# EAGLE schematic board (EAGLE 9.6.0)
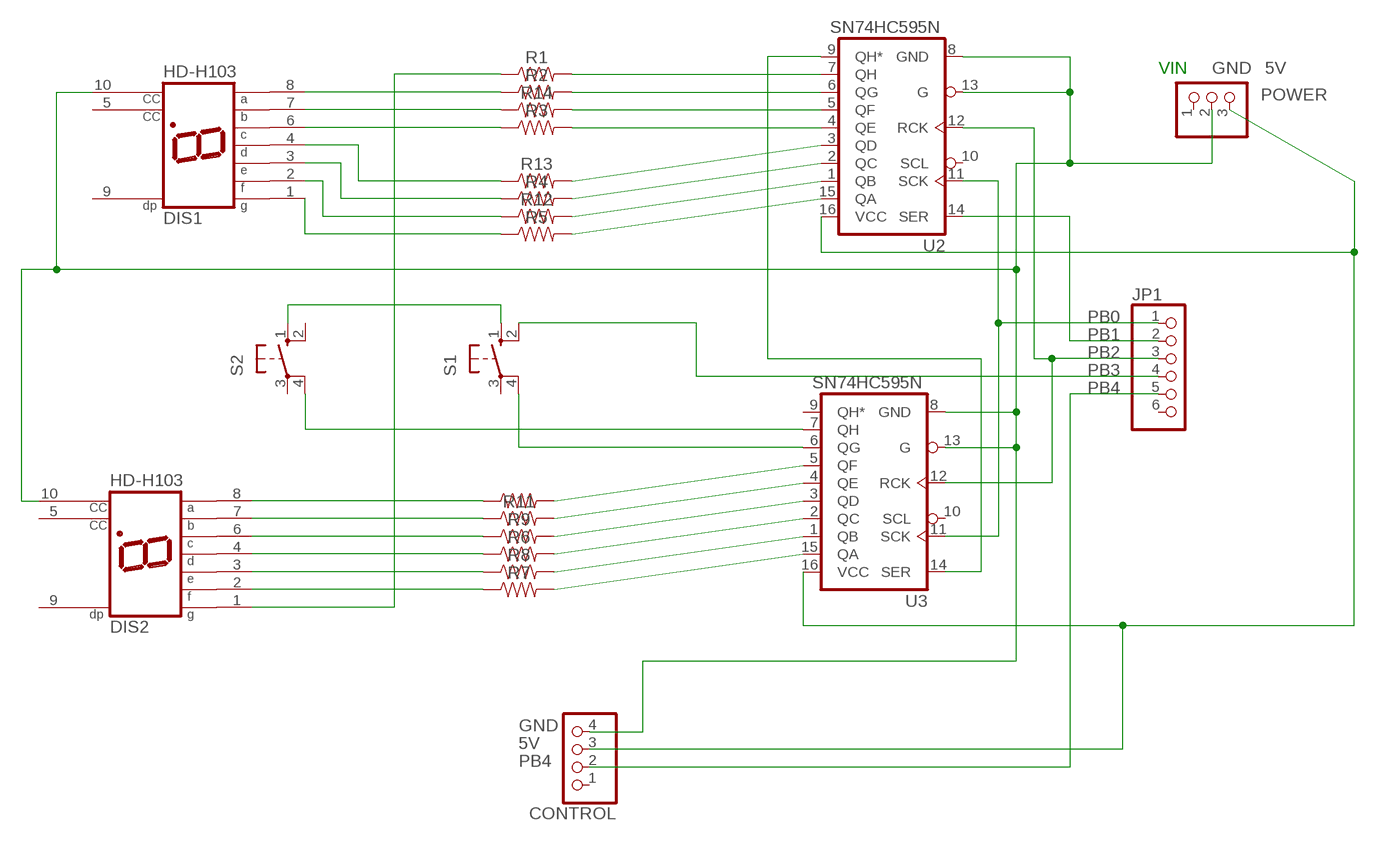
[diagram p0: schematic, sheet 1]

## Parts
CONTROL  PINHD-1X4  [1X04]
DIS1  HD-H103  [HDSP-M]
DIS2  HD-H103  [HDSP-M]
JP1  PINHD-1X6  [1X06]
POWER  PINHD-1X3  [1X03]
R1  RESISTORAXIAL-0.3  [AXIAL-0.3]
R2  RESISTORAXIAL-0.3  [AXIAL-0.3]
R3  RESISTORAXIAL-0.3  [AXIAL-0.3]
R4  RESISTORAXIAL-0.3  [AXIAL-0.3]
R5  RESISTORAXIAL-0.3  [AXIAL-0.3]
R6  RESISTORAXIAL-0.3  [AXIAL-0.3]
R7  RESISTORAXIAL-0.3  [AXIAL-0.3]
R8  RESISTORAXIAL-0.3  [AXIAL-0.3]
R9  RESISTORAXIAL-0.3  [AXIAL-0.3]
R11  RESISTORAXIAL-0.3  [AXIAL-0.3]
R12  RESISTORAXIAL-0.3  [AXIAL-0.3]
R13  RESISTORAXIAL-0.3  [AXIAL-0.3]
R14  RESISTORAXIAL-0.3  [AXIAL-0.3]
R15  RESISTORAXIAL-0.3  [AXIAL-0.3]
S1  40-XX  [B3F-40XX]
S2  40-XX  [B3F-40XX]
U2  SN74HC595N  74HC595N  [DIP16]
U3  SN74HC595N  74HC595N  [DIP16]

## Nets
5V: CONTROL.3 POWER.3 U2.16(VCC) U3.16(VCC)
GND: CONTROL.4 DIS1.10(CC) DIS2.10(CC) POWER.2 U2.8(GND) U2.13(G) U3.8(GND) U3.13(G)
N$1: S1.1(S) S2.1(S)
N$2: DIS1.1(F) R5.P$1
N$3: U2.9(QH*) U3.14(SER)
N$4: DIS1.2(G) R12.P$1
N$5: R1.P$2 U2.7(QH)
N$6: R2.P$2 U2.6(QG)
N$7: R14.P$2 U2.5(QF)
N$8: R3.P$2 U2.4(QE)
N$9: R13.P$2 U2.3(QD)
N$10: R4.P$2 U2.2(QC)
N$11: R12.P$2 U2.1(QB)
N$12: R5.P$2 U2.15(QA)
N$13: R9.P$2 U3.3(QD)
N$14: R6.P$2 U3.2(QC)
N$15: R8.P$2 U3.1(QB)
N$16: R7.P$2 U3.15(QA)
N$17: DIS1.3(A) R4.P$1
N$18: DIS1.4(B) R13.P$1
N$19: R15.P$2 U3.5(QF)
N$20: R11.P$2 U3.4(QE)
N$21: DIS1.6(E) R3.P$1
N$22: DIS1.7(D) R14.P$1
N$23: DIS1.8(C) R2.P$1
N$24: DIS2.8(C) R15.P$1
N$25: DIS2.7(D) R11.P$1
N$26: DIS2.6(E) R9.P$1
N$27: DIS2.4(B) R6.P$1
N$28: DIS2.3(A) R8.P$1
N$29: DIS2.2(G) R7.P$1
N$30: DIS2.1(F) R1.P$1
N$35: S1.4(P1) U3.6(QG)
N$36: S2.4(P1) U3.7(QH)
PB0: JP1.1 U2.11(SCK) U3.11(SCK)
PB1: JP1.2 U2.14(SER)
PB2: JP1.3 U2.12(RCK) U3.12(RCK)
PB3: JP1.4 S1.2(S1)
PB4: CONTROL.2 JP1.5
Unconnected: CONTROL.1 DIS1.5(CC) DIS1.9(DP) DIS2.5(CC) DIS2.9(DP) JP1.6 POWER.1 S1.3(P) S2.2(S1) S2.3(P) U2.10(SCL) U3.9(QH*) U3.10(SCL)

## Notes on the sheet
- VIN

## Library data of the parts
CONTROL = pinhead:PINHD-1X4: PIN HEADER
DIS1 DIS2 = display-hp_custom:HD-H103: LED DISPLAY 1-character 7 segment, decimal point right; OC_FARNELL: unknown; OC_NEWARK: unknown
JP1 = adafruit:PINHD-1X6: PIN HEADER
POWER = pinhead:PINHD-1X3: PIN HEADER
R1-R9 R11-R15 = SparkFun-Resistors:RESISTOR: Generic Resistor Package
S1 S2 = adafruit:40-XX: OMRON SWITCH; MF: OMRON COMPONENTS USA; MPN: B3F-4000; OC_FARNELL: 176434; OC_NEWARK: 36K3105
U2 U3 = SparkFun-IC-Logic:74*595: 8-Bit Shift Register (Serial to Parallel) Datasheet <http://cdn.sparkfun.com/datasheets/BreakoutBoards/MM74HC595.pdf> SparkFun Products SparkFun Shift Register Breakout - 74HC595 <https://www.sparkfun.com/products/10680> (BOB-10680); PROD_ID: IC-13123